# EAGLE design working (EAGLE 6.5.0)
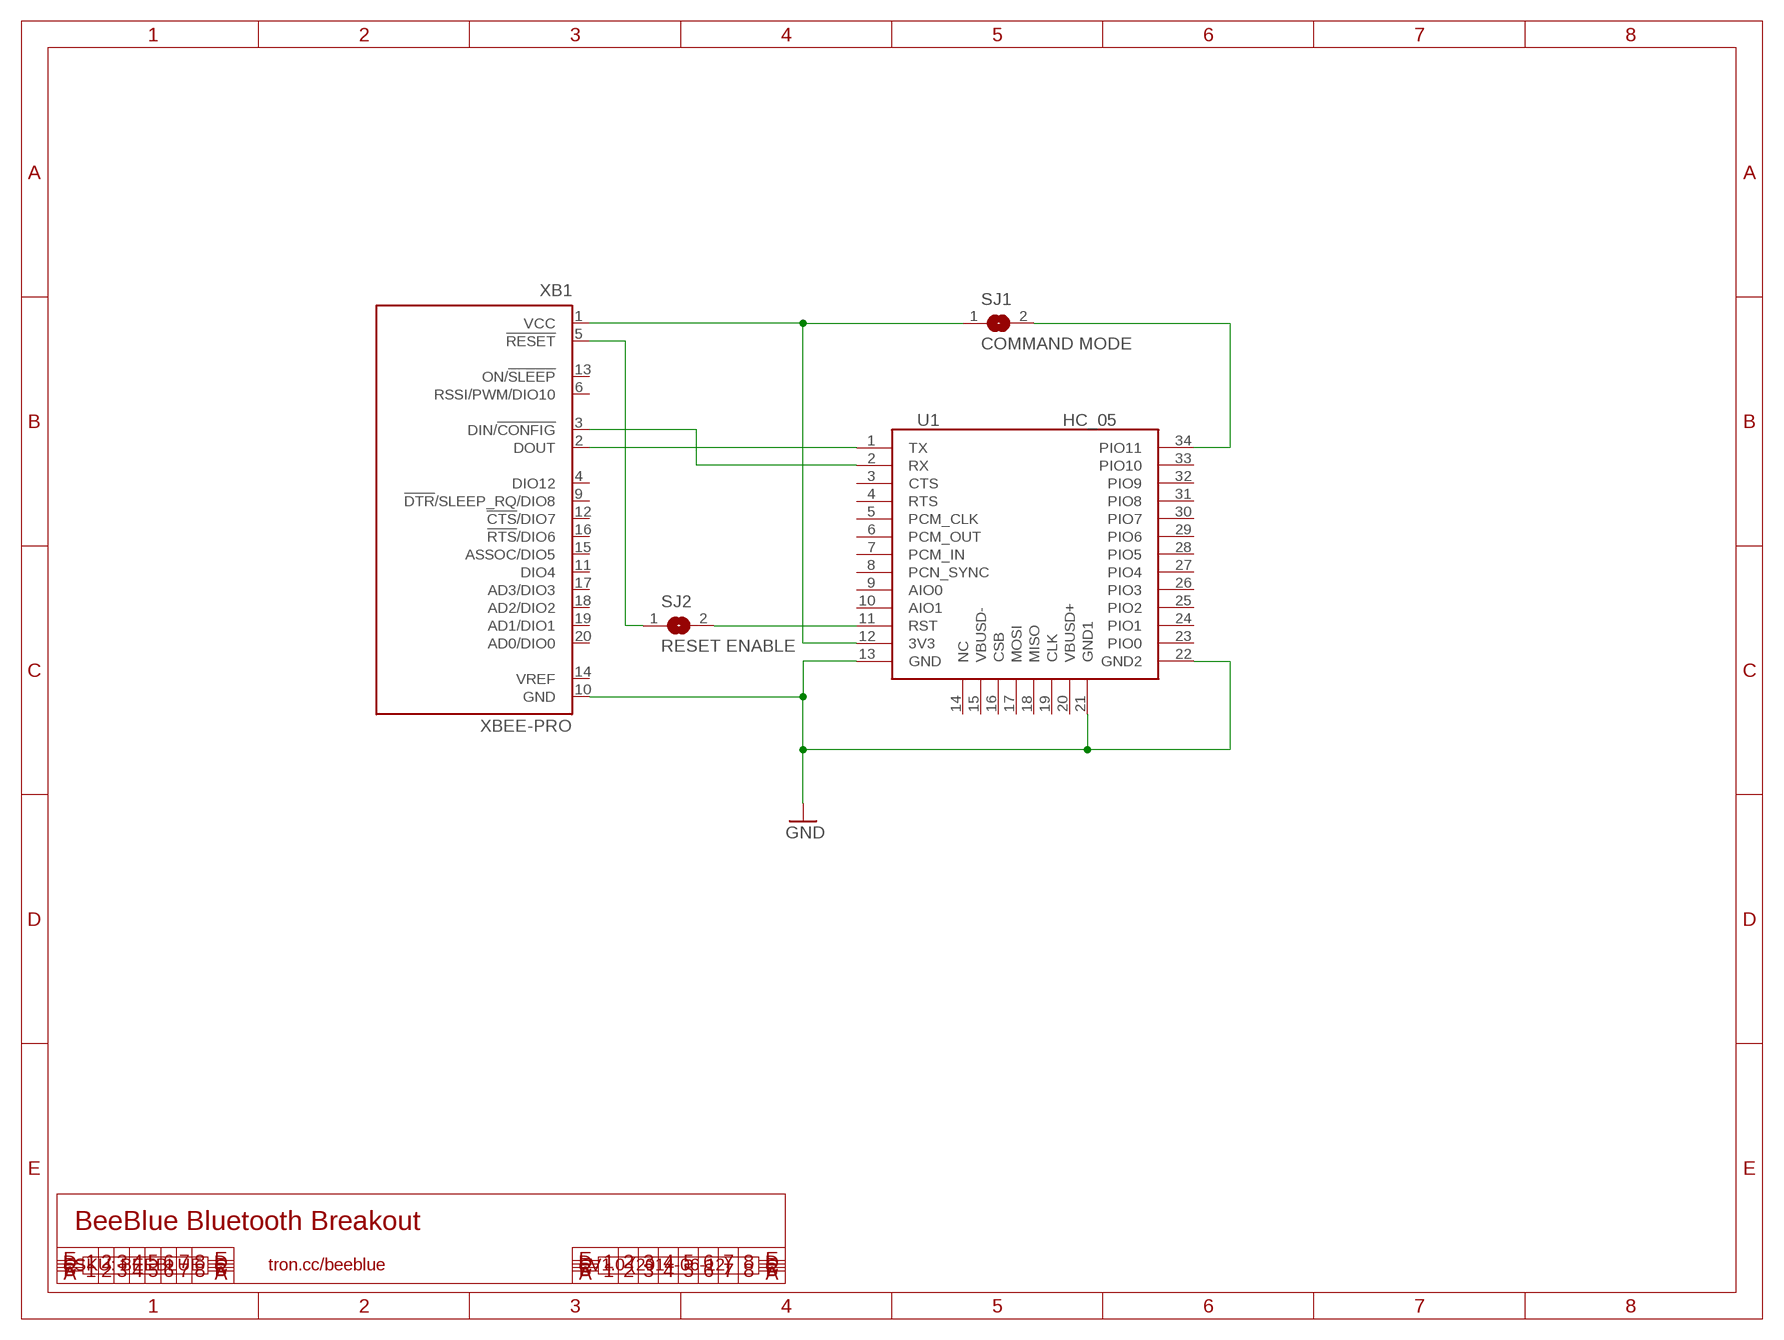
[diagram p0: schematic, sheet 1]

## Parts
SJ1  COMMAND MODE  SJN  [SJ]
SJ2  RESET ENABLE  SJN  [SJ]
U1  HC_05  [BLUETOOTH_SMD]
XB1  XBEE-PRO  [XBEE-PRO]

## Nets
GND: U1.13(GND) U1.21(GND1) U1.22(GND2) XB1.10(GND)
N$1: SJ1.2 U1.34(PIO11)
N$2: U1.1(TX) XB1.2(DOUT)
N$3: U1.2(RX) XB1.3(DIN/!CONFIG)
N$4: SJ1.1 U1.12(3V3) XB1.1(VCC)
N$5: SJ2.2 U1.11(RST)
N$6: SJ2.1 XB1.5(!RESET)
Unconnected: U1.3(CTS) U1.4(RTS) U1.5(PCM_CLK) U1.6(PCM_OUT) U1.7(PCM_IN) U1.8(PCN_SYNC) U1.9(AIO0) U1.10(AIO1) U1.14(NC) U1.15(VBUSD-) U1.16(CSB) U1.17(MOSI) U1.18(MISO) U1.19(CLK) U1.20(VBUSD+) U1.23(PIO0) U1.24(PIO1) U1.25(PIO2) U1.26(PIO3) U1.27(PIO4) U1.28(PIO5) U1.29(PIO6) U1.30(PIO7) U1.31(PIO8) U1.32(PIO9) U1.33(PIO10) XB1.4(DIO12) XB1.6(RSSI/PWM/DIO10) XB1.9(!DTR!/SLEEP_RQ/DIO8) XB1.11(DIO4) XB1.12(!CTS!/DIO7) XB1.13(ON/!SLEEP) XB1.14(VREF) XB1.15(ASSOC/DIO5) XB1.16(!RTS!/DIO6) XB1.17(AD3/DIO3) XB1.18(AD2/DIO2) XB1.19(AD1/DIO1) XB1.20(AD0/DIO0)

## Notes on the sheet
- BeeBlue Bluetooth Breakout
- SKU: BEEBLUE | tron.cc/beeblue | V1.0 (2014-06-12)

## Library data of the parts
SJ1 SJ2 = freetronics-jon:SJ: SMD solder JUMPER
U1 = freetronics-jon:HC_05
XB1 = freetronics-jon:XBEE: XBee (TM) /XBee-PRO(TM) OEM RF Modules Source: MaxStream, Inc. xbee_productmanual.pdf; MPN: XBP24-AWI-001; OC_FARNELL: 1337916; OC_NEWARK: 42M2667

## Net classes
0 Default: width 0.203 mm
1 VCC: width 0.305 mm

## Board
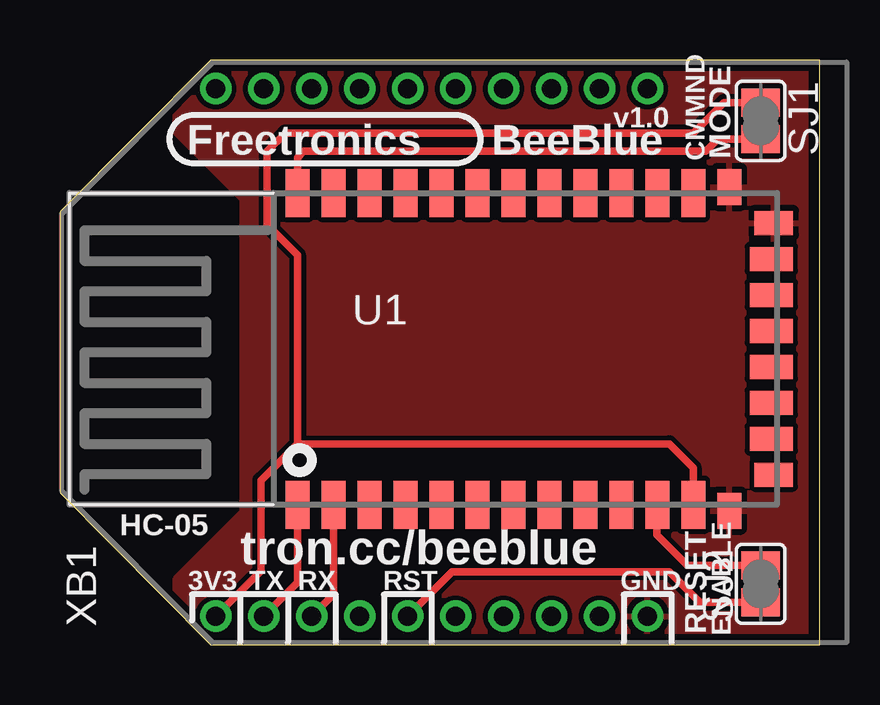
[diagram p1: board, top side]
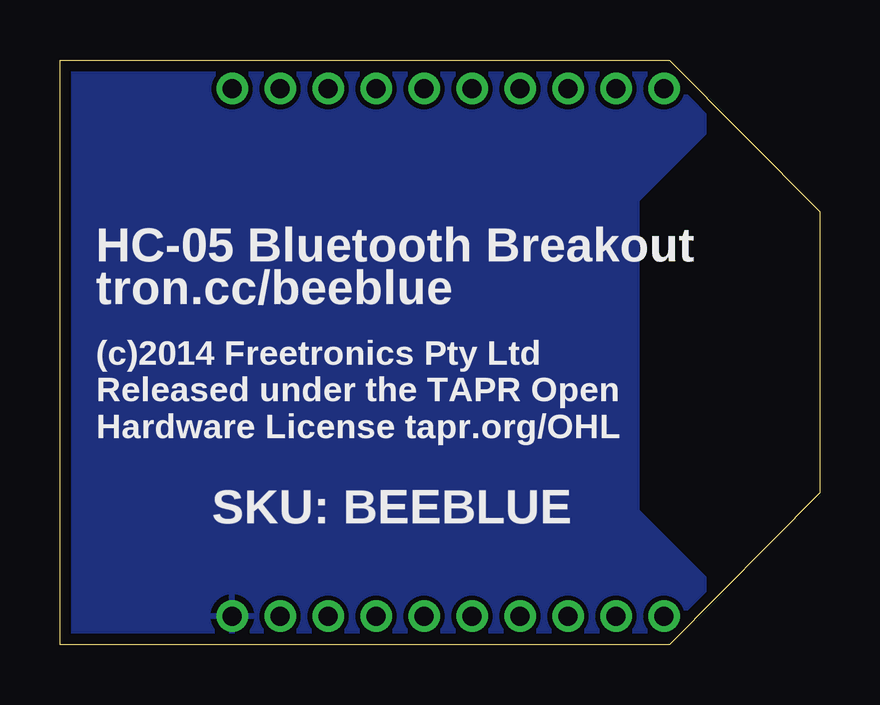
[diagram p2: board, bottom side, seen from below]

Size 31.67 x 24.38 mm. Coordinates in mm from the lower left corner, seen from the top.
Outline: 0,6.33 6.27,0 31.67,0 31.67,24.38 6.27,24.38 0,18.06 0,6.33
Copper layers (1*16): Top 0.035mm / dielectric 1.5mm / Bottom 0.035mm
Design rules "default": minimum track width 8mil, minimum drill 15mil, track to track 8mil, track to pad 8mil, pad to pad 8mil, via to via 8mil, smd to smd 8mil, copper to edge 18mil, drill to drill 8mil, minimum pad ring 10mil, minimum via ring 6mil, stop-mask expansion 4mil, vias tented up to drill 25mil, thermal gap 10mil

### Footprints (pad centres in the part's own frame; a part is rotated, then mirrored left to right if it is on the bottom)
SJ = smd 1.168 x 1.6: 1 -0.762,0; 2 0.762,0
BLUETOOTH_SMD = smd 1 x 2: 1 -5.08,-6.35; 2 -3.58,-6.35; 3 -2.08,-6.35; 4 -0.58,-6.35; 5 0.92,-6.35; 6 2.42,-6.35; 7 3.92,-6.35; 8 5.42,-6.35; 9 6.92,-6.35; 10 8.42,-6.35; 11 9.92,-6.35; 12 11.42,-6.35; 23 11.42,6.65; 24 9.92,6.65; 25 8.42,6.65; 26 6.92,6.65; 27 5.42,6.65; 28 3.92,6.65; 29 2.42,6.65; 30 0.92,6.65; 31 -0.58,6.65; 32 -2.08,6.65; 33 -3.58,6.65; 34 -5.08,6.65 | smd 1 x 1.5: 13 12.92,-6.6; 22 12.92,6.9 | smd 1.6 x 1: 14 14.77,-5.1; 21 14.77,5.4 | smd 1.8 x 1: 15 14.67,-3.6; 16 14.67,-2.1; 17 14.67,-0.6; 18 14.67,0.9; 19 14.67,2.4; 20 14.67,3.9
XBEE-PRO = drill 0.8 pad 1.27: 1 -11,9; 2 -11,7; 3 -11,5; 4 -11,3; 5 -11,1; 6 -11,-1; 7 -11,-3; 8 -11,-5; 9 -11,-7; 10 -11,-9; 11 11,-9; 12 11,-7; 13 11,-5; 14 11,-3; 15 11,-1; 16 11,1; 17 11,3; 18 11,5; 19 11,7; 20 11,9

### Placement (x,y rotation side)
SJ1  29.21,21.84 270 top
SJ2  29.21,2.54 90 top
U1  14.99,12.19 0 top
XB1  15.49,12.19 90 top

### Tracks (layer width: path | path; a pad name or v marks a point on that pad's centre or on a via)
GND
  pour Bottom: 7.62,5.56 7.62,18.57 4.83,21.36 4.83,22.86 6.27,24.38 31.67,24.38 31.67,0 6.27,0 4.83,1.52 4.83,2.77
  pour Top: 7.62,5.56 7.62,18.57 4.83,21.36 4.83,22.86 6.27,24.38 31.67,24.38 31.67,0 6.27,0 4.83,1.52 4.83,2.77
N$1
  Top 0.305: SJ1.2 27.43,21.08 26.92,20.57 10.16,20.57 9.91,20.32 U1.34
N$2
  Top 0.305: XB1.2 9.91,2.6 U1.1
N$3
  Top 0.305: XB1.3 11.41,2.1 U1.2
N$4
  Top 0.305: XB1.1 8.38,3.08 8.38,6.86 9.91,8.38 | 9.91,8.38 25.4,8.38 26.41,7.38 U1.12 | SJ1.1 27.69,22.61 26.42,21.34 9.4,21.34 8.64,20.57 8.64,17.53 9.91,16.26 9.91,8.38
N$5
  Top 0.305: SJ2.2 26.16,3.3 24.89,4.57 24.89,5.57 U1.11
N$6
  Top 0.305: SJ2.1 26.67,1.78 25.4,3.05 16.35,3.05 XB1.5

### Text on the board
tPlace: v1.0 | Freetronics | BeeBlue | CMMND | MODE | HC-05 | tron.cc/beeblue | 3V3 | TX | RX | RST | GND | RESET | ENABLE
bPlace: HC-05 Bluetooth Breakout | tron.cc/beeblue | (c)2014 Freetronics Pty Ltd / Released under the TAPR Open / Hardware License tapr.org/OHL | SKU: BEEBLUE